# Altium schematic sheet FanPump.SchDoc
size A
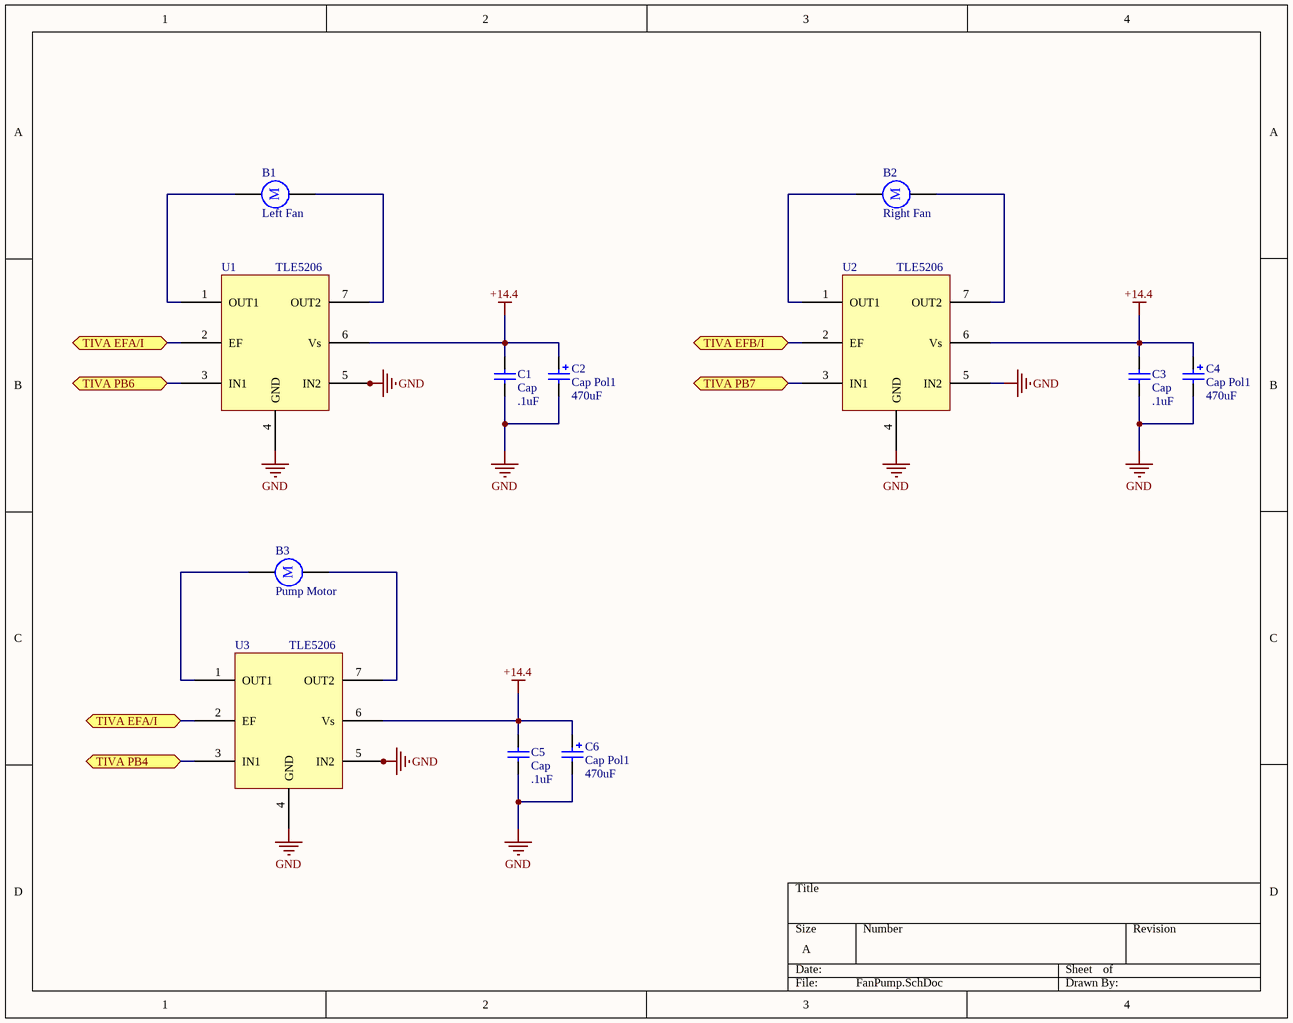
[diagram p0: FanPump.SchDoc]

## Parts
B1  Left Fan  [RB5-10.5]
B2  Right Fan  [RB5-10.5]
B3  Pump Motor  [RB5-10.5]
C1  Cap  value .1uF  [RAD-0.3]
C2  Cap Pol1  value 470uF  [RB7.6-15]
C3  Cap  value .1uF  [RAD-0.3]
C4  Cap Pol1  value 470uF  [RB7.6-15]
C5  Cap  value .1uF  [RAD-0.3]
C6  Cap Pol1  value 470uF  [RB7.6-15]
U1  TLE5206
U2  TLE5206
U3  TLE5206

## Ports
TIVA EFA/I, TIVA EFB/I, TIVA PB4, TIVA PB6, TIVA PB7

## Nets
+14.4: C1.2 C2.1 C3.2 C4.1 C5.2 C6.1 U1.6(Vs) U2.6(Vs) U3.6(Vs)
GND: C1.1 C2.2 C3.1 C4.2 C5.1 C6.2 U1.4(GND) U1.5(IN2) U2.4(GND) U2.5(IN2) U3.4(GND) U3.5(IN2)
TIVA EFA/I: U1.2(EF) U3.2(EF) ; port TIVA EFA/I
TIVA EFB/I: U2.2(EF) ; port TIVA EFB/I
TIVA PB4: U3.3(IN1) ; port TIVA PB4
TIVA PB6: U1.3(IN1) ; port TIVA PB6
TIVA PB7: U2.3(IN1) ; port TIVA PB7
NetB1_1: B1.1 U1.1(OUT1)
NetB1_2: B1.2 U1.7(OUT2)
NetB2_1: B2.1 U2.1(OUT1)
NetB2_2: B2.2 U2.7(OUT2)
NetB3_1: B3.1 U3.1(OUT1)
NetB3_2: B3.2 U3.7(OUT2)

## Notes on the sheet
- (in symbol Motor) M

## Library data of the parts
B1-B3 = Motor: Motor, General Kind; Manufacturer: Generic Components; Published: 1999
C1 C3 C5 = Cap: Capacitor; Manufacturer: Generic Components; Class: Passive; Published: 08/06/2000; Publisher: Altium Hobart Technology Centre; SubClass: Capacitor
C2 C4 C6 = Cap Pol1: Polarized Capacitor (Radial); Manufacturer: Generic Components; Class: Passive; Published: 08/06/2000; Publisher: Altium Hobart Technology Centre; SubClass: Capacitor